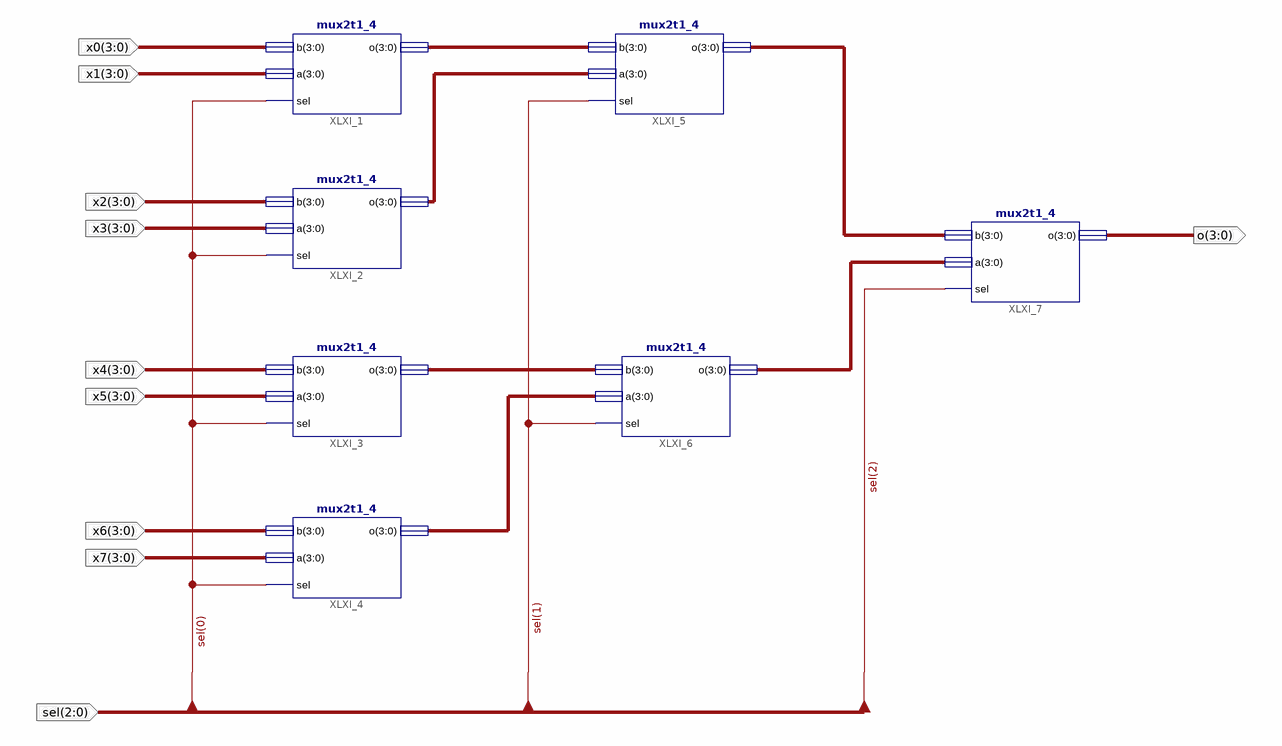
[diagram p0: schematic sheet 1]
// Xilinx ISE schematic mux8t1_4.sch (kintex7) as structural Verilog: 7 symbols, 10 ports
module mux8t1_4 (
  input  [3:0] x0,
  input  [3:0] x1,
  input  [3:0] x2,
  input  [3:0] x3,
  input  [3:0] x4,
  input  [3:0] x5,
  input  [3:0] x6,
  input  [3:0] x7,
  input  [2:0] sel,
  output [3:0] o
);

  wire [3:0] XLXN_22, XLXN_32, XLXN_33, XLXN_34, XLXN_35, XLXN_36;

  mux2t1_4 XLXI_1 (.b(x0), .a(x1), .sel(sel[0]), .o(XLXN_32));
  mux2t1_4 XLXI_2 (.b(x2), .a(x3), .sel(sel[0]), .o(XLXN_22));
  mux2t1_4 XLXI_3 (.b(x4), .a(x5), .sel(sel[0]), .o(XLXN_33));
  mux2t1_4 XLXI_4 (.b(x6), .a(x7), .sel(sel[0]), .o(XLXN_34));
  mux2t1_4 XLXI_5 (.b(XLXN_32), .a(XLXN_22), .sel(sel[1]), .o(XLXN_35));
  mux2t1_4 XLXI_6 (.b(XLXN_33), .a(XLXN_34), .sel(sel[1]), .o(XLXN_36));
  mux2t1_4 XLXI_7 (.b(XLXN_35), .a(XLXN_36), .sel(sel[2]), .o(o));
endmodule
